# Altium project DecoLED_PCB.PrjPcb
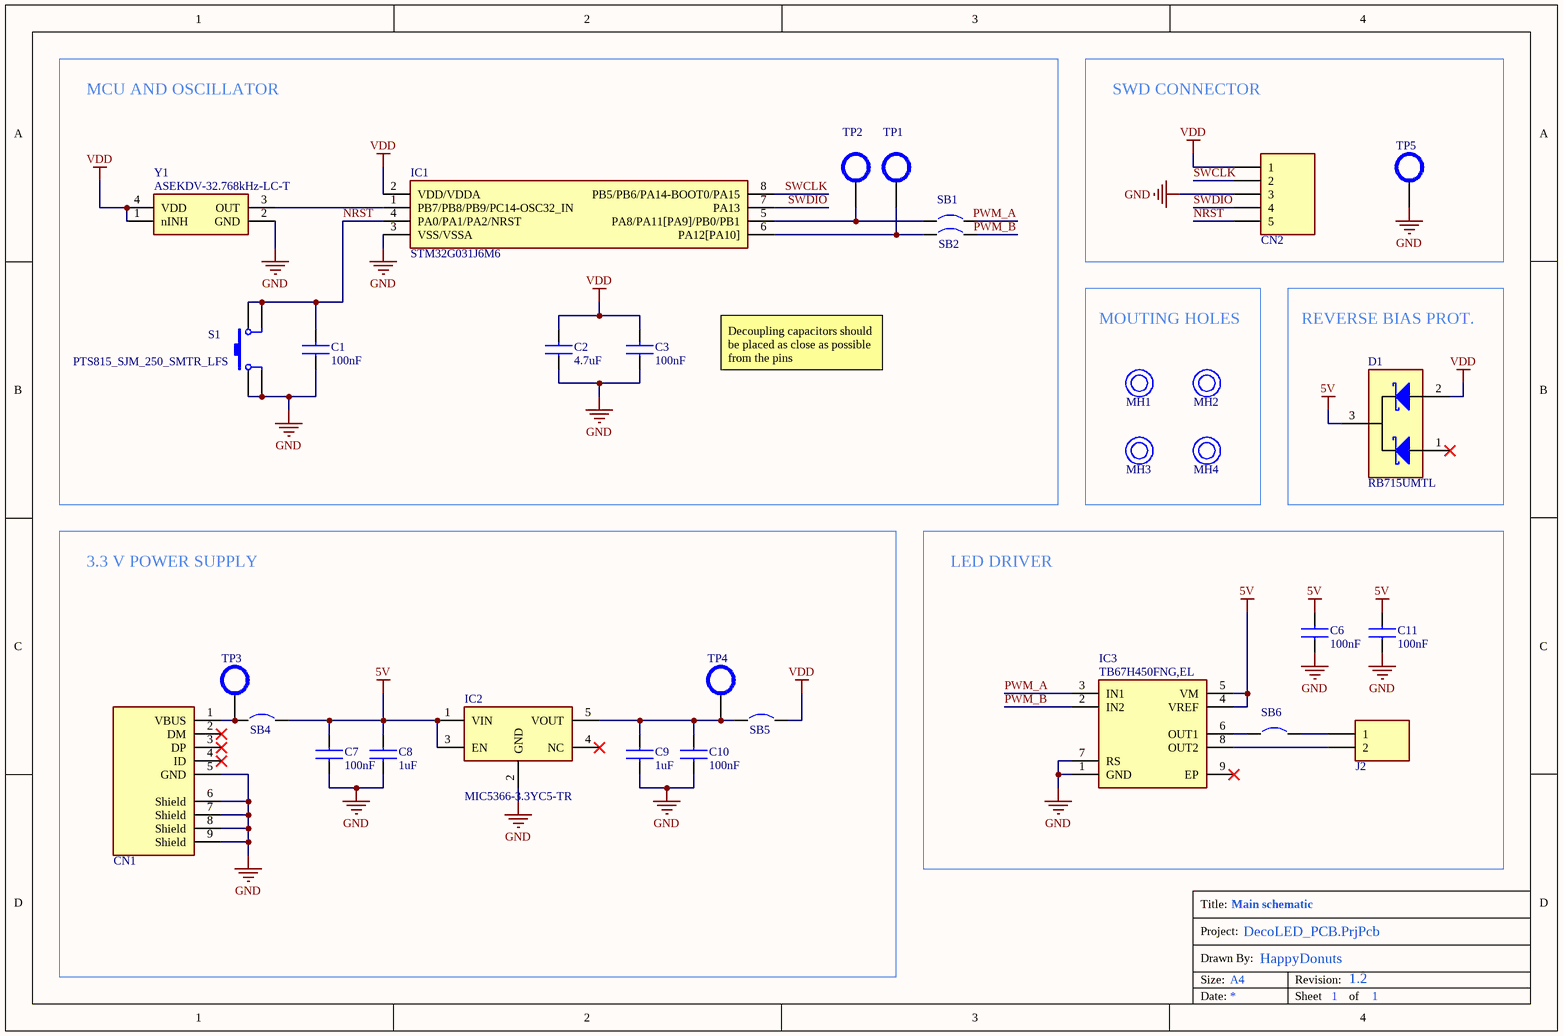
[diagram p0: main.SchDoc]
1 sheet, 32 parts. Net scope: global (net labels, ports and power ports of the same name join across sheets).
Board file: PCB1.PcbDoc

## Sheet main.SchDoc: Main schematic
size A4; Author: HappyDonuts; Revision: 1.2; SheetNumber: 1; SheetTotal: 1

### Parts
C1  value 100nF  [CAPC2012X94N]  (hidden comment: C0805C104K5RAC7411)
C2  value 4.7uF  [CAPC2012X135N]  (hidden comment: CL21A475KPFNNNE)
C3  value 100nF  [CAPC2012X94N]  (hidden comment: C0805C104K5RAC7411)
C6  value 100nF  [CAPC2012X94N]  (hidden comment: C0805C104K5RAC7411)
C7  value 100nF  [CAPC2012X94N]  (hidden comment: C0805C104K5RAC7411)
C8  value 1uF  [CAPC2012X135N]  (hidden comment: 885012107015)
C9  value 1uF  [CAPC2012X135N]  (hidden comment: 885012107015)
C10  value 100nF  [CAPC2012X94N]  (hidden comment: C0805C104K5RAC7411)
C11  value 100nF  [CAPC2012X94N]  (hidden comment: C0805C104K5RAC7411)
CN1  920-E52A2021S10100  [USB307530A]  (value not drawn)
CN2  CN_5PIN  [CN_5PIN]  (value not drawn)
D1  RB715UMTL  [DAN217UMTL]
IC1  STM32G031J6M6  [SOIC127P600X175-8N]
IC2  MIC5366-3.3YC5-TR  [SOT65P210X110-5N]
IC3  TB67H450FNG,EL  [SOIC127P600X175-9N]
J2  B2B-PH-K-S_LF__SN_  [SHDR2W50P0X200_1X2_590X450X600P]  (value not drawn)
MH1  MOUNTING_HOLE_NP  [MOUNTING_HOLE_NP]  (value not drawn)  (no BOM)
MH2  MOUNTING_HOLE_NP  [MOUNTING_HOLE_NP]  (value not drawn)  (no BOM)
MH3  MOUNTING_HOLE_NP  [MOUNTING_HOLE_NP]  (value not drawn)  (no BOM)
MH4  MOUNTING_HOLE_NP  [MOUNTING_HOLE_NP]  (value not drawn)  (no BOM)
S1  PTS815_SJM_250_SMTR_LFS  [EVP-BT3G4A000]
SB1  RC0805FR-070RL  [RESC2012X60N]  (value not drawn)
SB2  RC0805FR-070RL  [RESC2012X60N]  (value not drawn)
SB4  RC0805FR-070RL  [RESC2012X60N]  (value not drawn)
SB5  RC0805FR-070RL  [RESC2012X60N]  (value not drawn)
SB6  RC0805FR-070RL  [RESC2012X60N]  (value not drawn)
TP1  TEST_POINT  [TEST_POINT]  (value not drawn)  (no BOM)
TP2  TEST_POINT  [TEST_POINT]  (value not drawn)  (no BOM)
TP3  TEST_POINT  [TEST_POINT]  (value not drawn)  (no BOM)
TP4  TEST_POINT  [TEST_POINT]  (value not drawn)  (no BOM)
TP5  TEST_POINT  [TEST_POINT]  (value not drawn)  (no BOM)
Y1  ASEKDV-32.768kHz-LC-T  [ASEKDV-32.768kHz-LC-T]

### Blocks framed on the sheet
MCU AND OSCILLATOR: C1-C3 IC1 S1 SB1 SB2 TP1 TP2 Y1
SWD CONNECTOR: CN2 TP5
MOUTING HOLES: MH1-MH4
REVERSE BIAS PROT.: D1
3.3 V POWER SUPPLY: C7-C10 CN1 IC2 SB4 SB5 TP3 TP4
LED DRIVER: C6 C11 IC3 J2 SB6

### Nets
5V: C6.2 C7.2 C8.2 C11.2 D1.3(COM_A) IC2.1(VIN) IC2.3(EN) IC3.4(VREF) IC3.5(VM) SB4.2
GND: C1.1 C2.1 C3.1 C6.1 C7.1 C8.1 C9.1 C10.1 C11.1 CN1.5(GND) CN1.6(Shield) CN1.7(Shield) CN1.8(Shield) CN1.9(Shield) CN2.3 IC1.3(VSS/VSSA) IC2.2(GND) IC3.1(GND) IC3.7(RS) S1.1 S1.2 TP5.TP Y1.2(GND)
VDD: C2.2 C3.2 CN2.1 D1.2(K_2) IC1.2(VDD/VDDA) SB5.2 Y1.1(nINH) Y1.4(VDD)
NRST: C1.2 CN2.5 IC1.4(PA0/PA1/PA2/NRST) S1.3 S1.4
PWM_A: IC3.3(IN1) SB1.1
PWM_B: IC3.2(IN2) SB2.1
SWCLK: CN2.2 IC1.8(PB5/PB6/PA14-BOOT0/PA15)
SWDIO: CN2.4 IC1.7(PA13)
NetC9_2: C9.2 C10.2 IC2.5(VOUT) SB5.1 TP4.TP
NetCN1_1: CN1.1(VBUS) SB4.1 TP3.TP
NetIC1_1: IC1.1(PB7/PB8/PB9/PC14-OSC32_IN) Y1.3(OUT)
NetIC1_5: IC1.5(PA8/PA11[PA9]/PB0/PB1) SB1.2 TP2.TP
NetIC1_6: IC1.6(PA12[PA10]) SB2.2 TP1.TP
NetIC3_6: IC3.6(OUT1) SB6.1
NetIC3_8: IC3.8(OUT2) J2.2
NetJ2_1: J2.1 SB6.2

Not connected (* = marked no-connect by the designer): CN1 2(DM)* 3(DP)* 4(ID)*; D1 1(K_1)*; IC2 4(NC)*; IC3 9(EP)*

### Notes on the sheet
- Decoupling capacitors should be placed as close as possible from the pins
- Title:
- Size:
- Date:
- Drawn By:
- Project:
- A4
- Revision:
- Sheet
- of

### Library data of the parts
C1 C3 C6 C7 C10 C11 = C0805C104K5RAC7411: Capacitor; Manufacturer_Name: Kemet; Datasheet Link: https://www.mouser.com/datasheet/2/212/KEM_C1002_X7R_SMD-1102033.pdf; Height: 0.88mm; Manufacturer_Part_Number: C0805C104K5RAC7411; Mouser Part Number: 80-C0805C104K5RACLR; Mouser Price/Stock: https://www.mouser.co.uk/ProductDetail/KEMET/C0805C104K5RAC7411?qs=jbRM9o5BbzPcVXF0wW9AYg%3D%3D; Arrow Part Number: C0805C104K5RAC7411; Arrow Price/Stock: https://www.arrow.com/en/products/c0805c104k5rac7411/kemet-corporation
C2 = CL21A475KPFNNNE: Capacitor; Manufacturer_Name: Wurth Elektronik; Datasheet Link: https://www.mouser.fr/datasheet/2/585/MLCC-1837944.pdf; Height: 1.35mm; Manufacturer_Part_Number: CL21A475KPFNNNE; Mouser Part Number: 187-CL21A475KPFNNNE; Mouser Price/Stock: https://www.mouser.co.uk/ProductDetail/Wurth-Elektronik/885012107015?qs=0KOYDY2FL2%252BNQREZP%252BtVoQ%3D%3D
C8 C9 = 885012107015: Capacitor; Manufacturer_Name: Wurth Elektronik; Datasheet Link: https://katalog.we-online.com/pbs/datasheet/885012107015.pdf; Height: 1.35mm; Manufacturer_Part_Number: 885012107015; Mouser Part Number: 710-885012107015; Mouser Price/Stock: https://www.mouser.co.uk/ProductDetail/Wurth-Elektronik/885012107015?qs=0KOYDY2FL2%252BNQREZP%252BtVoQ%3D%3D
CN1 = 920-E52A2021S10100: USB connector; Manufacturer_Name: Jing Extension of the Electronic Co.; Datasheet Link: http://toshiba.semicon-storage.com/info/docget.jsp?did=65346&prodName=TB67H450FNG; Height: 1.9mm; Manufacturer_Part_Number: https://datasheet.lcsc.com/lcsc/2103051832_Jing-Extension-of-the-Electronic-Co--920-E52A2021S10100_C10418.pdf; Mouser Part Number: 920-E52A2021S10100; Mouser Price/Stock: https://www.mouser.co.uk/ProductDetail/Toshiba/TB67H450FNGEL?qs=h6V4JsTaLXeReNg2bp0jug%3D%3D; Arrow Part Number: TB67H450FNG,EL; Arrow Price/Stock: https://www.arrow.com/en/products/tb67h450fngel/toshiba?region=nac
CN2 = CN_5PIN: Connector
D1 = RB715UMTL: Schottky Diode; Manufacturer_Name: ROHM Semiconductor; Datasheet Link: http://uk.rs-online.com/web/p/products/1835297; Height: 1mm; Manufacturer_Part_Number: RB715UMTL; Mouser Part Number: 755-RB715UMTL; Mouser Price/Stock: https://www.mouser.co.uk/ProductDetail/ROHM-Semiconductor/RB715UMTL?qs=HXFqYaX1Q2wTXMfu8QxCQg%3D%3D
IC1 = STM32G031J6M6: Integrated Circuit; Manufacturer_Name: STMicroelectronics; Datasheet Link: https://www.mouser.fr/datasheet/2/389/dm00613879-1799607.pdf; Height: 1.75mm; Manufacturer_Part_Number: STM32G031J6M6; Mouser Part Number: 511-STM32G031J6M6
IC2 = MIC5366-3.3YC5-TR: LDO; Manufacturer_Name: Microchip; Value: 3.3V/150mA; Datasheet Link: https://www.mouser.fr/datasheet/2/268/MIC5365_6_High_Performance_Single_150mA_LDO_DS2000-2826882.pdf; Height: 1.1mm; Manufacturer_Part_Number: MIC5366-3.3YC5-TR; Mouser Part Number: 998-MIC5366-3.3YC5TR; Mouser Price/Stock: https://www.mouser.co.uk/ProductDetail/Microchip-Technology-Micrel/MIC5365-33YC5-TR?qs=U6T8BxXiZAXvJj%252BPZ%252B301w%3D%3D; Arrow Part Number: MIC5365-3.3YC5-TR; Arrow Price/Stock: https://www.arrow.com/en/products/mic5365-3.3yc5-tr/microchip-technology?region=nac
IC3 = TB67H450FNG,EL: Integrated Circuit; Manufacturer_Name: Toshiba; Datasheet Link: http://toshiba.semicon-storage.com/info/docget.jsp?did=65346&prodName=TB67H450FNG; Height: 1.75mm; Manufacturer_Part_Number: TB67H450FNG,EL; Mouser Part Number: 757-TB67H450FNGEL; Mouser Price/Stock: https://www.mouser.co.uk/ProductDetail/Toshiba/TB67H450FNGEL?qs=h6V4JsTaLXeReNg2bp0jug%3D%3D; Arrow Part Number: TB67H450FNG,EL; Arrow Price/Stock: https://www.arrow.com/en/products/tb67h450fngel/toshiba?region=nac
J2 = B2B-PH-K-S_LF__SN_: Connector; Manufacturer_Name: JST (JAPAN SOLDERLESS TERMINALS); Manufacturer_Part_Number: B2B-PH-K-S(LF)(SN); Datasheet Link: https://datasheet.lcsc.com/szlcsc/JST-Sales-America-B2B-PH-K-S-LF-SN_C131337.pdf; Height: 6mm; Arrow Part Number: B2B-PH-K-S(LF)(SN); Arrow Price/Stock: https://www.arrow.com/en/products/b2b-ph-k-s-lf-sn/jst-manufacturing
MH1-MH4 = MOUNTING_HOLE_NP: Mounting hole
S1 = PTS815_SJM_250_SMTR_LFS: Switch; Manufacturer_Name: C & K COMPONENTS; Manufacturer_Part_Number: PTS815 SJM 250 SMTR LFS; Datasheet Link: https://componentsearchengine.com/Datasheets/1/PTS815 SJM 250 SMTR LFS.pdf; Height: 2.7mm; Mouser Part Number: 611-PTS815SJM250SMTR; Mouser Price/Stock: https://www.mouser.co.uk/ProductDetail/CK/PTS815-SJM-250-SMTR-LFS?qs=ahcBuItHZ3xKWmfV%2F2E6bA%3D%3D; Arrow Part Number: PTS815 SJM 250 SMTR LFS; Arrow Price/Stock: https://www.arrow.com/en/products/pts815-sjm-250-smtr-lfs/ck
SB1 SB2 SB4-SB6 = RC0805FR-070RL: Jumper (0 ohm); Manufacturer_Name: YAGEO (PHYCOMP); Datasheet Link: https://datasheet.datasheetarchive.com/originals/distributors/Datasheets_SAMA/902f9e387b938f871d31120f5fc1d65e.pdf; Height: 0.6mm; Manufacturer_Part_Number: RC0805FR-070RL; Mouser Part Number: 603-RC0805FR-070RL; Mouser Price/Stock: https://www.mouser.co.uk/ProductDetail/YAGEO/RC0805FR-070RL?qs=fRxXYNj8ftF6kXqh1XbZJQ%3D%3D
TP1-TP5 = TEST_POINT: Test point
Y1 = ASEKDV-32.768kHz-LC-T: Crystal or Oscillator; Manufacturer_Name: ABRACON; Datasheet Link: https://www.mouser.fr/datasheet/2/3/ABRC_S_A0012625913_1-2519507.pdf; Height: 1.2mm; Manufacturer_Part_Number: ASEKDV-32.768kHz-LC-T; Mouser Part Number: 815-ASEKDV32768KHLCT; Value: 32.768kHz